# Altium schematic sheet Sheet1.SchDoc
size A3; SheetNumber: 1; SheetTotal: 1
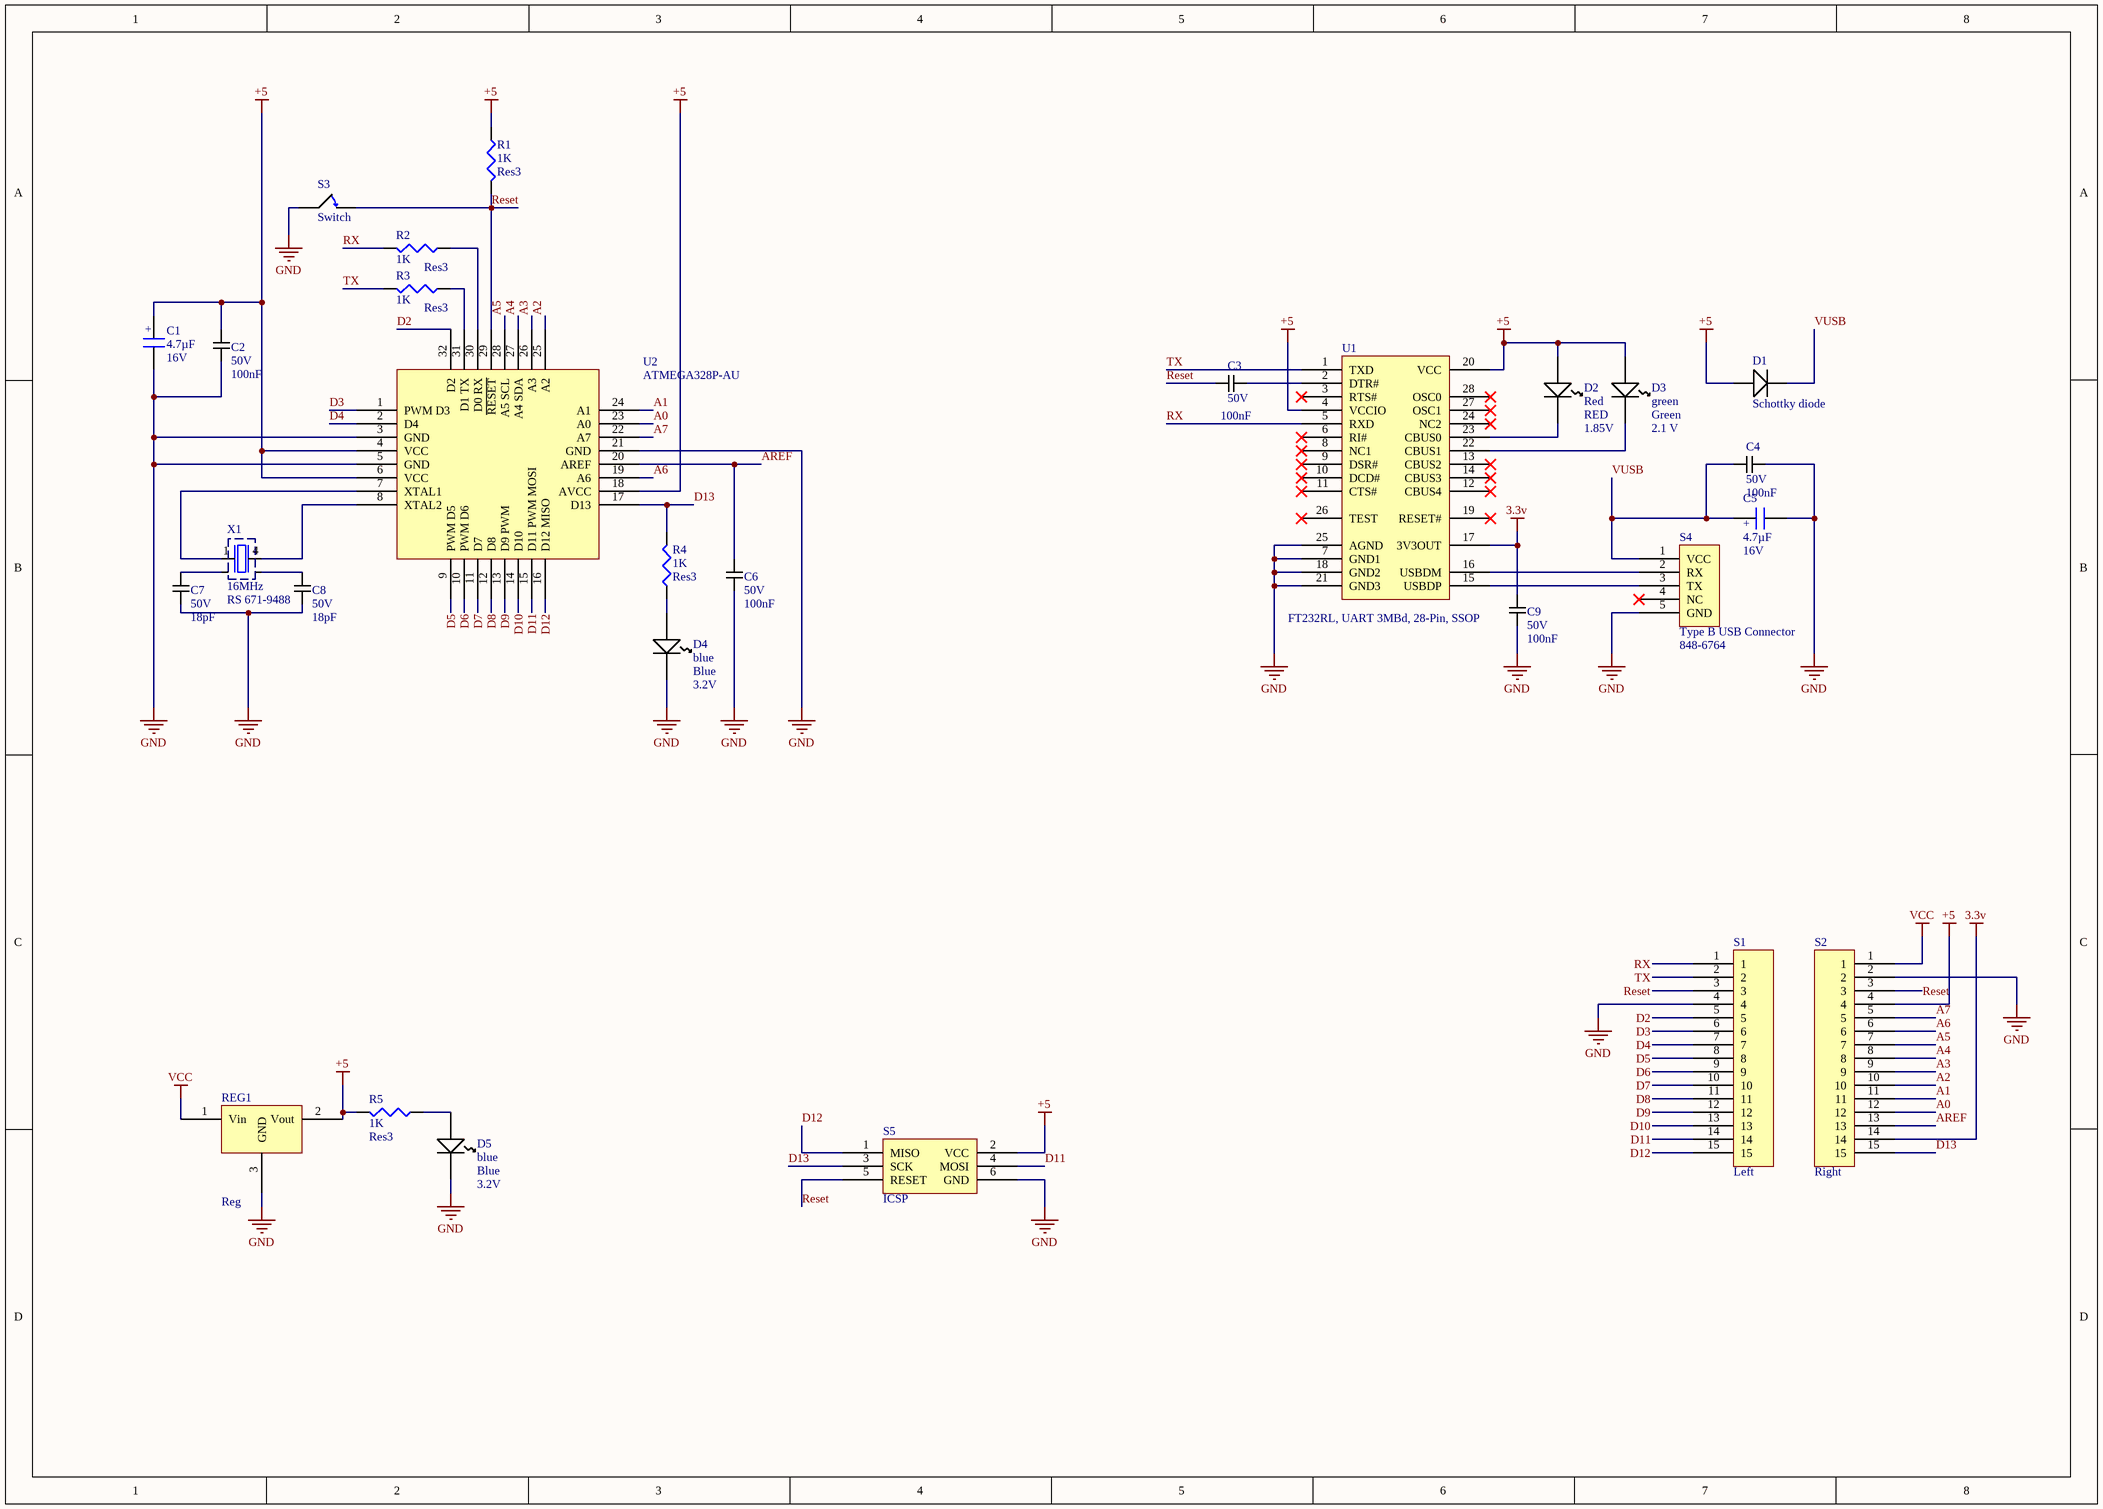
[diagram p0: Sheet1.SchDoc]

## Parts
C1  value 4.7µF  Voltage: 16V  [CASE A - 3216X18]  (hidden comment: Capacitor SMT Tantalum)
C2  Voltage: 50V  Capacitance: 100nF  [CAPCP2012X09N]  (hidden comment: 100nF Ceramic Multilayer Capacitor_1)
C3  Voltage: 50V  Capacitance: 100nF  [CAPCP2012X09N]  (hidden comment: 100nF Ceramic Multilayer Capacitor_1)
C4  Voltage: 50V  Capacitance: 100nF  [CAPCP2012X09N]  (hidden comment: 100nF Ceramic Multilayer Capacitor_1)
C5  value 4.7µF  Voltage: 16V  [CASE A - 3216X18]  (hidden comment: Capacitor SMT Tantalum)
C6  Voltage: 50V  Capacitance: 100nF  [CAPCP2012X09N]  (hidden comment: 100nF Ceramic Multilayer Capacitor_1)
C7  Voltage: 50V  Capacitance: 18pF  [CAPCP2012X09N]  (hidden comment: C0805C180J5GACTU)
C8  Voltage: 50V  Capacitance: 18pF  [CAPCP2012X09N]  (hidden comment: C0805C180J5GACTU)
C9  Voltage: 50V  Capacitance: 100nF  [CAPCP2012X09N]  (hidden comment: 100nF Ceramic Multilayer Capacitor_1)
D1  Schottky diode  [DIOM1712X07N]
D2  Red  Forward Voltage: 1.85V  [LED1913X12NRED]
D3  green  Forward Voltage: 2.1 V  [LED1913X12NGREEN]
D4  blue  Forward Voltage: 3.2V  [LED1913X12NBLUE]
D5  blue  Forward Voltage: 3.2V  [LED1913X12NBLUE]
R1  Res3  value 1K  [J1-0603]
R2  Res3  value 1K  [J1-0603]
R3  Res3  value 1K  [J1-0603]
R4  Res3  value 1K  [J1-0603]
R5  Res3  value 1K  [J1-0603]
REG1  Reg  [SOT230P700X180-4N]
S1  Left  [Header]
S2  Right  [Header]
S3  Switch  [Tactile Switch]
S4  Type B USB Connector  RS Stock No: 848-6764  [MicroUSB]
S5  ICSP  [ISP HEADER]
U1  FT232RL, UART 3MBd, 28-Pin, SSOP  [SOP65P780X200-28N]
U2  ATMEGA328P-AU  [TQFP80P900X900X120-32N]
X1  value 16MHz  RS: RS 671-9488  [Aker S5C Crystal]  (hidden comment: Aker 16MHz Crystal SMT)

## Nets
3.3v: C9.1 S2.14 U1.17(3V3OUT)
+5: C1.1 C2.2 D1.2 D2.1(A) D3.1(A) R1.1 R5.2 REG1.2(Vout) S2.4 S5.2(VCC) U1.4(VCCIO) U1.20(VCC) U2.4(VCC) U2.6(VCC) U2.18(AVCC)
GND: C1.2 C2.1 C4.2 C5.2 C6.1 C7.1 C8.1 C9.2 D4.2(K) D5.2(K) REG1.3(GND) S1.4 S2.2 S3.1 S4.5(GND) S5.6(GND) U1.7(GND1) U1.18(GND2) U1.21(GND3) U1.25(AGND) U2.3(GND) U2.5(GND) U2.21(GND)
VCC: REG1.1(Vin) S2.1
A0: S2.12 U2.23(A0)
A1: S2.11 U2.24(A1)
A2: S2.10 U2.25(A2)
A3: S2.9 U2.26(A3)
A4: S2.8 U2.27(A4_SDA)
A5: S2.7 U2.28(A5_SCL)
A6: S2.6 U2.19(A6)
A7: S2.5 U2.22(A7)
AREF: C6.2 S2.13 U2.20(AREF)
D2: S1.5 U2.32(D2)
D3: S1.6 U2.1(PWM_D3)
D4: S1.7 U2.2(D4)
D5: S1.8 U2.9(PWM_D5)
D6: S1.9 U2.10(PWM_D6)
D7: S1.10 U2.11(D7)
D8: S1.11 U2.12(D8)
D9: S1.12 U2.13(D9_PWM)
D10: S1.13 U2.14(D10)
D11: S1.14 S5.4(MOSI) U2.15(D11_PWM_MOSI)
D12: S1.15 S5.1(MISO) U2.16(D12_MISO)
D13: R4.2 S2.15 S5.3(SCK) U2.17(D13)
Reset: C3.1 R1.2 S1.3 S2.3 S3.2 S5.5(RESET) U2.29(~{RESET})
RX: R2.2 S1.1 U1.5(RXD)
TX: R3.2 S1.2 U1.1(TXD)
VUSB: C4.1 C5.1 D1.1 S4.1(VCC)
NetC3_2: C3.2 U1.2(DTR#)
NetC7_2: C7.2 X1.3(Gnd)
NetC8_2: C8.2 X1.2(Gnd)
NetD2_2: D2.2(K) U1.23(CBUS0)
NetD3_2: D3.2(K) U1.22(CBUS1)
NetD4_1: D4.1(A) R4.1
NetD5_1: D5.1(A) R5.1
NetR2_1: R2.1 U2.30(D0_RX)
NetR3_1: R3.1 U2.31(D1_TX)
NetS4_2: S4.2(RX) U1.16(USBDM)
NetS4_3: S4.3(TX) U1.15(USBDP)
NetU2_7: U2.7(XTAL1) X1.1
NetU2_8: U2.8(XTAL2) X1.4

Not connected (* = marked no-connect by the designer): S4 4(NC)*; U1 3(RTS#)* 6(RI#)* 8(NC1)* 9(DSR#)* 10(DCD#)* 11(CTS#)* 12(CBUS4)* 13(CBUS2)* 14(CBUS3)* 19(RESET#)* 24(NC2)* 26(TEST)* 27(OSC1)* 28(OSC0)*

## Notes on the sheet
- (in symbol 4.7µF Tant RS 496-3545) +

## Library data of the parts
C1 C5 = 4.7µF Tant RS 496-3545: Capacitor,tantalum,SMT,16V,4.7uF,10%,A-case; Part Originator: H Theron; RS Stock Nr.: 496-3545; Tolerance: 10%; Package: 3216-18; Publisher: DPSS; LatestRevisionDate: 28-April-2010; ComponentLink1Description: Supplier Website; ComponentLink1URL: http://za.rs-online.com/web/search/searchBrowseAction.html?method=getProduct&R=4963545; ComponentLink2Description: RS Data sheet; ComponentLink2URL: http://docs-europe.origin.electrocomponents.com/webdocs/04ed/0900766b804ed4cc.pdf
C2-C4 C6 C9 = 100nF Ceramic Multilayer Capacitor_1: AVX 0805 Standard 100nF Ceramic Multilayer Capacitor, 50 V dc X7R Dielectric ±10% SMD; Creator: Ritesh Kanjee; Date Created: 18 February 2015; Package: 0805; Manufacturer: AVX; RS Stock No.: 464-6688; Datasheet URL: http://za.rs-online.com/web/p/ceramic-multilayer-capacitors/4646688/
C7 C8 = 18pF Ceramic Multilayer Capacitor, 50 V dc C0G Dielectric ±5% SMD: Manufacturer: Kemet; Creator: Ritesh Kanjee; Date Created: 18 February 2015; Package: 0805; RS Stock No.: 648-0935; Datasheet URL: http://za.rs-online.com/web/p/ceramic-multilayer-capacitors/6480935/?searchTerm=C0805C180J5GACTU&relevancy-data=636F3D3226696E3D4931384E4B6E6F776E41734D504E266C753D656E266D6D3D6D61746368616C6C7061727469616C26706D3D5E5B5C707B4C7D5C707B4E647D2D2C2F255C2E5D2B2426706F3D313326736E3D592673743D4D414E5F504152545F4E554D4245522677633D424F5448267573743D4330383035433138304A35474143545526
D1 = Schottky Diode, 0.5A, 20V, 2.4ns, 2-Pin SMini2 F5 B: Panasonic DB2J20900L Schottky Diode, 0.5A, 20V, 2.4ns, 2-Pin SMini2 F5 B; Created By: R Kanjee; Date Created: 1 March 2015; Manufacturer: Panasonic; RS Stock No.: 713-2703; Manufacturer Part No.: DB2J20900L; Datasheet: http://docs-europe.electrocomponents.com/webdocs/1398/0900766b813986b3.pdf; Maximum Continuous Forward Current: 0.5A; Peak Reverse Repetitive Voltage: 20V
D2 = Kingbright Red LED, 100 mcd 120 ° 0805: Manufacturer Part No.: KP-2012SRC-PRV; Creator: Ritesh Kanjee; Date Created: 18 February 2015; Manufacturer: KingBright; RS Stock No.: 466-3813; Datasheet URL: http://za.rs-online.com/web/p/visible-leds/4663813/; Color: RED
D3 = Kingbright Green LED, 70 mcd 120 ° 0805: Manufacturer Part No.: KP-2012MGC; Creator: Ritesh Kanjee; Date Created: 18 February 2015; Manufacturer: KingBright; RS Stock No.: 466-3778; Datasheet URL: http://za.rs-online.com/web/p/visible-leds/4663778/; Color: Green
D4 D5 = Kingbright Blue LED, 60 mcd 120 ° 0805: Manufacturer Part No.: KP-2012PBC-A; Creator: Ritesh Kanjee; Date Created: 18 February 2015; Manufacturer: KingBright; RS Stock No.: 466-3784; Datasheet URL: http://za.rs-online.com/web/p/visible-leds/4663784/; Color: Blue
R1-R5 = Res3: Resistor; Published: 8-Jun-2000; LatestRevisionDate: 29-May-2009; LatestRevisionNote: IPC-7351 Footprint Added.; PackageReference: J1-0603; Publisher: Altium Limited; PackageDescription: Chip Resistor
REG1 = LM1117MP-5.0: LM1117MP-5.0/NOPB, Low Dropout Voltage Regulator, 1.5A, 5 V ±1%, 4-Pin SOT-223; Manufacturer: Texas Instruments; Supply Current: 1.5Amps; Output Voltage: 5V; Maximum Input Voltage: 15V; Date Created: 26 February 2015; Created By: R Kanjee; RS Stock No.: 533-9583; Datasheet URL: http://za.rs-online.com/web/p/low-dropout-voltage-regulators/5339583/
S1 S2 = Single row; PCB headers: connector;str header;single row;.1 cont centers;.095 tail;gold or gtx;36 contact; Manufacturer: FCI; Manufacturer Part No.: 68000-236HLF; Current Rating: 3Amps Continuous; Created By: R Kanjee; Date Created: 1 March 2015; RS Stock No.: 2509565626
S3 = Tactile Switch SPST- NO 0.05A @24V: Manufacturer: Omron; Manufacturer Part No.: B3F1000; State: Normaly Open; Date Created: 25 February 2015; Creator: R Kanjee; RS Stock No.: 686-6847
S4 = Micro USB Connector, 30 V ac, 1.8A: NewMolex Right Angle SMT Female Type B Micro USB Connector, 30 V ac, 1.8A; Manufacturer: Molex; Manufacturer Part No.: 105017-0001; Max Voltage: 30V; Creator: R Kanjee; Date Created: 28 February 2015; Datasheet URL: http://za.rs-online.com/web/p/micro-usb-connectors/8486764/; Max Current: 1.8A
S5 = Programming ISP, Programming Headers Dual Row: Programming Headers Dual Row; Manufacturer: FCI; Manufacturer Part No.: 68000-236HLF; Current Rating: 3Amps Continuous; Created By: R Kanjee; Date Created: 1 March 2015; RS Stock No.: 2509565626
U1 = FT232RL USB to UART, Universal Asynchronous Receiver & Transmitter 3MBd, 28-Pin, SSOP: FT232RL, Universal Asynchronous Receiver & Transmitter 3MBd, 28-Pin, SSOP; Manufacturer: FTDI Chip; Creator: R Kanjee; Date Created: 03 March 2015; Manufacturer Part No.: FT232RL; RS Stock No.: 406-580; Pin Count: 28
U2 = ATMEGA328P-AU: ATMEGA328P-AU, 8 bit AVR Microcontroller 20MHz 1 kB, 32 kB Flash, 2 kB RAM, I2C 32-Pin TQFP; Company: Lumina Inova; Created By: Ritesh Kanjee; Date Created: 14 February 2015; RS Stock No.: 696-3092; Datasheet URL: http://docs-europe.electrocomponents.com/webdocs/0db4/0900766b80db4deb.pdf
X1 = Aker  C5S-16.000-12-3030-X: Aker S5C SMT Crystal; Load Capacitance: 12pF; Frequency Stability: +/-30ppm; Creator: R Kanjee; Manufacturer: Aker; Manufacturer Part #: C5S-16.000-12-3030-X; Supplier: RS; RS Stock Nr.: 671-9488; HelpURL: http://za.rs-online.com/web/p/crystal-units/6719488/; Package: 3.2x5mm SMD